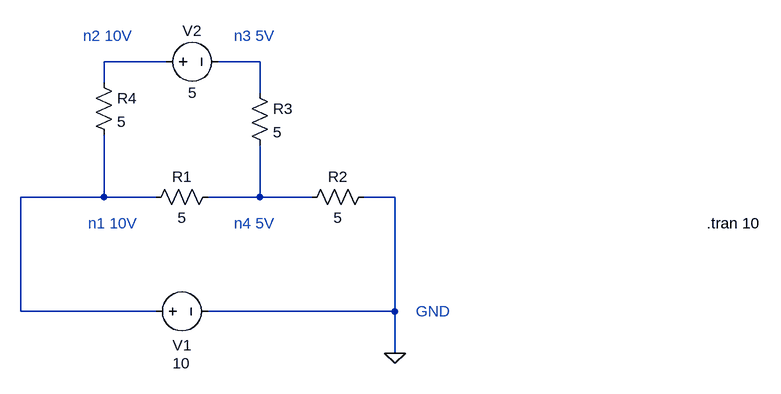
[diagram p0: schematic tc2_sim.asc]
tc2_sim.asc, the LTspice schematic file:
Version 4
SHEET 1 1136 680
WIRE 208 -208 112 -208
WIRE 352 -208 288 -208
WIRE 112 -176 112 -208
WIRE 352 -160 352 -208
WIRE 112 0 112 -96
WIRE 112 0 -16 0
WIRE 192 0 112 0
WIRE 352 0 352 -80
WIRE 352 0 272 0
WIRE 432 0 352 0
WIRE 560 0 512 0
WIRE -16 176 -16 0
WIRE 192 176 -16 176
WIRE 560 176 560 0
WIRE 560 176 272 176
WIRE 560 240 560 176
FLAG 560 240 0
SYMBOL voltage 176 176 R270
WINDOW 0 -52 42 VRight 2
WINDOW 3 -80 42 VRight 2
WINDOW 123 0 0 Left 0
WINDOW 39 0 0 Left 0
SYMATTR InstName V1
SYMATTR Value 10
SYMBOL res 176 16 R270
WINDOW 0 32 56 VTop 2
WINDOW 3 0 56 VBottom 2
SYMATTR InstName R1
SYMATTR Value 5
SYMBOL res 416 16 R270
WINDOW 0 32 56 VTop 2
WINDOW 3 0 56 VBottom 2
SYMATTR InstName R2
SYMATTR Value 5
SYMBOL res 336 -176 R0
SYMATTR InstName R3
SYMATTR Value 5
SYMBOL res 96 -192 R0
SYMATTR InstName R4
SYMATTR Value 5
SYMBOL voltage 192 -208 R270
WINDOW 0 32 56 VTop 2
WINDOW 3 -32 56 VBottom 2
WINDOW 123 0 0 Left 0
WINDOW 39 0 0 Left 0
SYMATTR InstName V2
SYMATTR Value 5
TEXT 1040 40 Left 2 !.tran 10
TEXT 88 40 Left 2 ;n1 10V
TEXT 80 -248 Left 2 ;n2 10V
TEXT 312 -248 Left 2 ;n3 5V
TEXT 312 40 Left 2 ;n4 5V
TEXT 592 176 Left 2 ;GND

The netlist it stands for:
* tc2_sim.asc
V1 N003 0 10
R1 N003 N004 5
R2 N004 0 5
R3 N002 N004 5
R4 N001 N003 5
V2 N001 N002 5
.tran 10
* n1 10V
* n2 10V
* n3 5V
* n4 5V
* GND
.backanno
.end